# EAGLE design MaquetaConejos_2 (EAGLE 9.5.1)
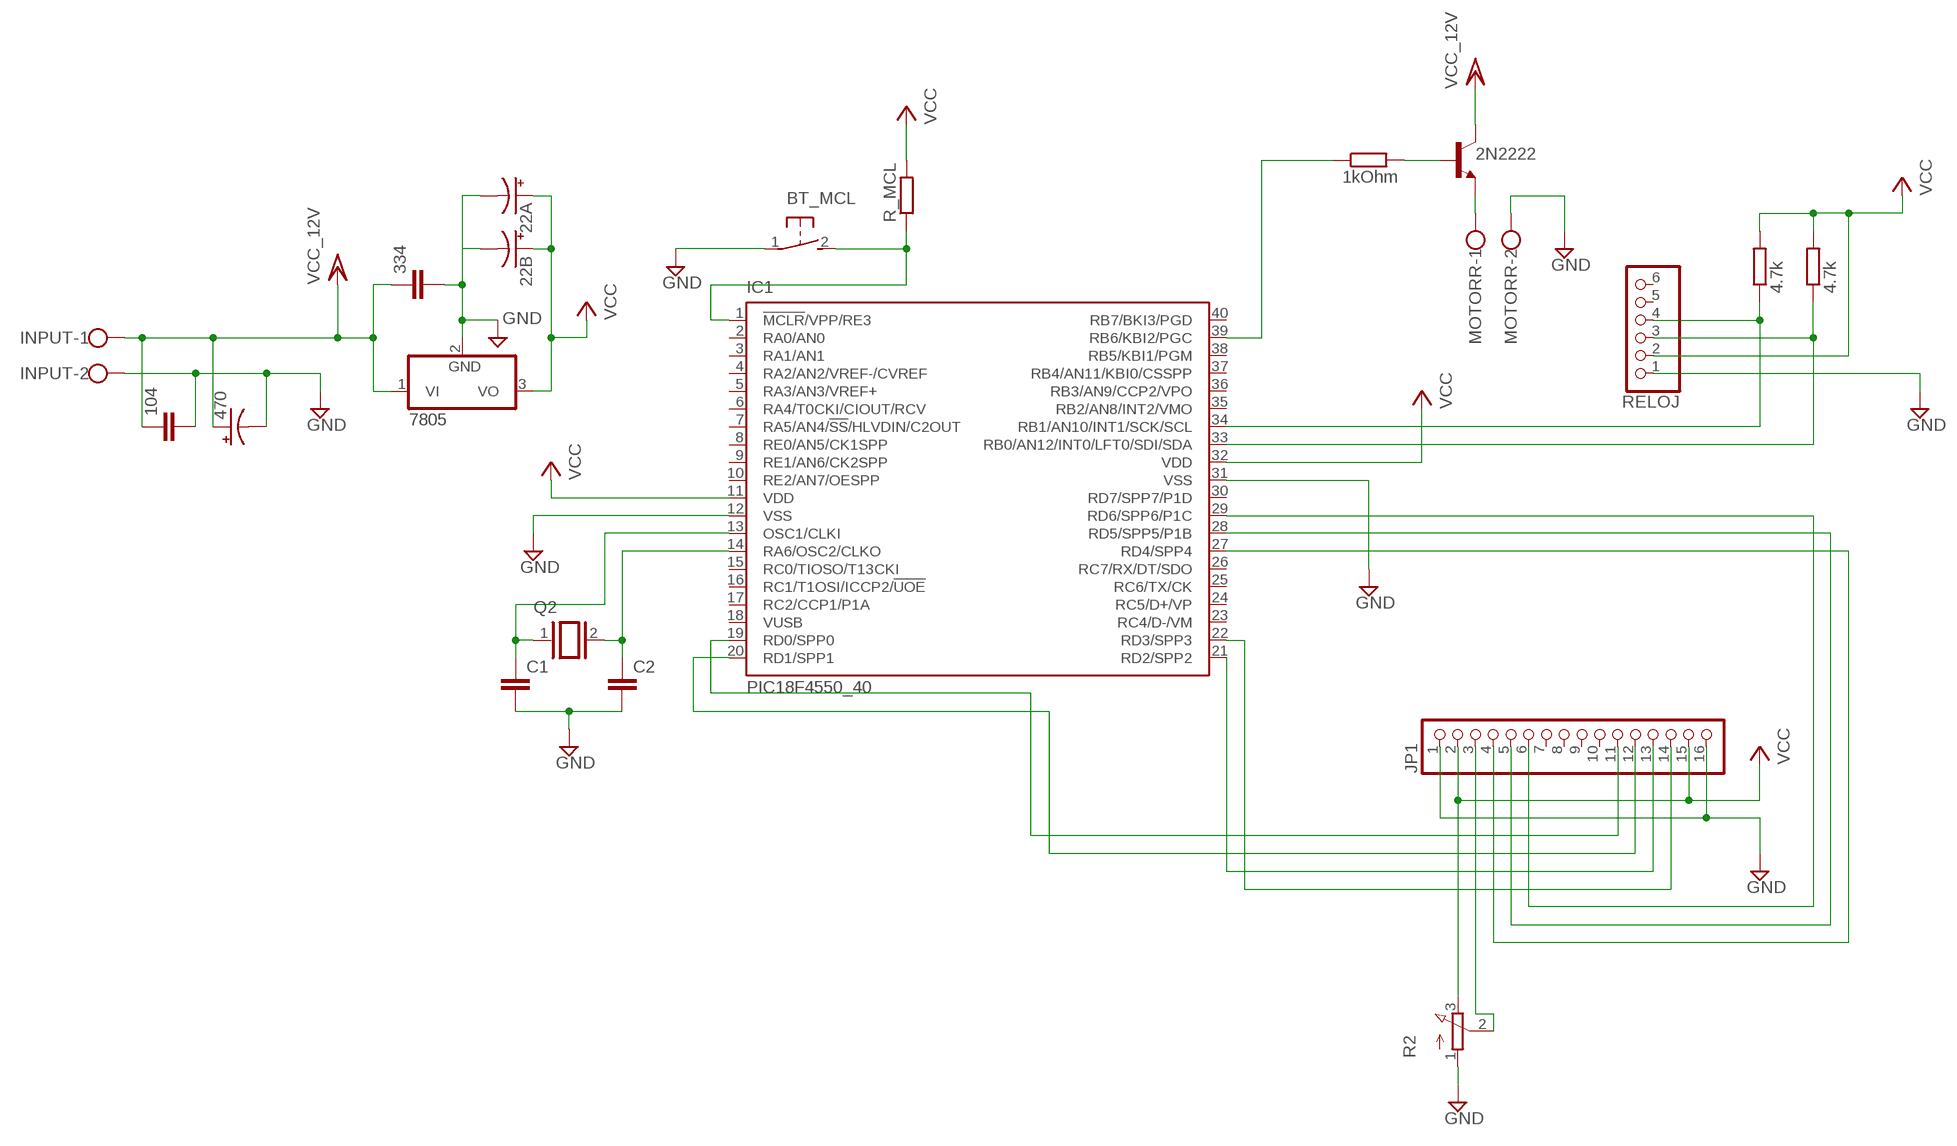
[diagram p0: schematic, sheet 1]

## Parts
22A  CPOL-USE1.8-4  [E1,8-4]
22B  CPOL-USE1.8-4  [E1,8-4]
104  C-EU050-025X075  [C050-025X075]
334  C-EU050-025X075  [C050-025X075]
470  CPOL-USE5-10.5  [E5-10,5]
BT_MCL  DTS-3  [DTS-3]
C1  C-EU025-024X044  [C025-024X044]
C2  C-EU025-024X044  [C025-024X044]
IC1  PIC18F4550_40  [DIL40]
IC3  7805  7805TV  [TO220V]
INPUT  W237-102  [W237-102]
JP1  PINHD-1X16  [1X16]
MOTORR  W237-102  [W237-102]
Q2  XTAL/S  [QS]
R1  4.7k  R-EU_0204/7  [0204/7]
R2  3RP/1610N  [3RP/1610N]
R3  1kOhm  R-EU_0204/7  [0204/7]
R4  4.7k  R-EU_0204/7  [0204/7]
R_MCL  R-EU_0204/7  [0204/7]
RELOJ  PINHD-1X6  [1X06]
T1  2N2222  [TO92-EBC-OVAL]

## Nets
GND: 22A.- 22B.- 104.2 334.2 470.- BT_MCL.1 C1.2 C2.2 IC1.12(VSS) IC1.31(VSS) IC3.2(GND) INPUT.2 JP1.1 JP1.16 MOTORR.2 R2.1(A) RELOJ.1
N$1: BT_MCL.2 IC1.1(!MCLR!/VPP/RE3) R_MCL.1
N$2: IC1.39(RB6/KBI2/PGC) R3.1
N$3: R3.2 T1.B
N$4: IC1.34(RB1/AN10/INT1/SCK/SCL) R4.1 RELOJ.4
N$5: MOTORR.1 T1.E
N$6: C1.1 IC1.13(OSC1/CLKI) Q2.1
N$7: C2.1 IC1.14(RA6/OSC2/CLKO) Q2.2
N$8: IC1.33(RB0/AN12/INT0/LFT0/SDI/SDA) R1.1 RELOJ.3
N$12: JP1.3 R2.2(S)
N$13: IC1.19(RD0/SPP0) JP1.11
N$15: IC1.20(RD1/SPP1) JP1.12
N$16: IC1.21(RD2/SPP2) JP1.13
N$17: IC1.22(RD3/SPP3) JP1.14
N$18: IC1.27(RD4/SPP4) JP1.4
N$19: IC1.29(RD6/SPP6/P1C) JP1.6
N$20: IC1.28(RD5/SPP5/P1B) JP1.5
VCC: 22A.+ 22B.+ IC1.11(VDD) IC1.32(VDD) IC3.3(VO) JP1.2 JP1.15 R1.2 R2.3(E) R4.2 R_MCL.2 RELOJ.2
VCC/2: 104.1 334.1 470.+ IC3.1(VI) INPUT.1 T1.C ; supply symbol labelled VCC_12V
Unconnected: IC1.2(RA0/AN0) IC1.3(RA1/AN1) IC1.4(RA2/AN2/VREF-/CVREF) IC1.5(RA3/AN3/VREF+) IC1.6(RA4/T0CKI/CIOUT/RCV) IC1.7(RA5/AN4/!SS!/HLVDIN/C2OUT) IC1.8(RE0/AN5/CK1SPP) IC1.9(RE1/AN6/CK2SPP) IC1.10(RE2/AN7/OESPP) IC1.15(RC0/TIOSO/T13CKI) IC1.16(RC1/T1OSI/ICCP2/!UOE) IC1.17(RC2/CCP1/P1A) IC1.18(VUSB) IC1.23(RC4/D-/VM) IC1.24(RC5/D+/VP) IC1.25(RC6/TX/CK) IC1.26(RC7/RX/DT/SDO) IC1.30(RD7/SPP7/P1D) IC1.35(RB2/AN8/INT2/VMO) IC1.36(RB3/AN9/CCP2/VPO) IC1.37(RB4/AN11/KBI0/CSSPP) IC1.38(RB5/KBI1/PGM) IC1.40(RB7/BKI3/PGD) JP1.7 JP1.8 JP1.9 JP1.10 RELOJ.5 RELOJ.6

## Library data of the parts
22A 22B 470 = rcl:CPOL-US: POLARIZED CAPACITOR, American symbol; SPICEPREFIX: C
104 334 C1 C2 = rcl:C-EU: CAPACITOR, European symbol; SPICEPREFIX: C
BT_MCL = switch-tact:DTS-3
IC1 = microchip:PIC18F4*_40: USB Microcontrollers with nanoWatt Technology High-Performance, Enhanced Flash, 28/40/44-Pin, Source: http://ww1.microchip.com/downloads/en/devicedoc/39632c.pdf; MF: MICROCHIP; MPN: PIC18F4550-I/P; OC_FARNELL: 9321357; OC_NEWARK: 74K8623
IC3 = linear:78*: Positive VOLTAGE REGULATOR Source: http://cache.national.com/ds/LM/LM78L05.pdf http://www.fairchildsemi.com/ds/LM/LM7805.pdf
INPUT MOTORR = con-wago-500:W237-102: WAGO SCREW CLAMP; MPN: 237-102; OC_FARNELL: unknown; OC_NEWARK: 70K9898
JP1 = pinhead:PINHD-1X16: PIN HEADER
Q2 = special:XTAL/S: CRYSTAL
R1 R3 R4 R_MCL = rcl:R-EU_: RESISTOR, European symbol; SPICEPREFIX: R
R2 = pot:3RP/1610N: 16mm Potentiometer one level Source: http://www.alphapotentiometers.net/html/16mm_pot_2.html
RELOJ = pinhead:PINHD-1X6: PIN HEADER
T1 = adafruit:2N2222: NPN TRANSISTOR Big oval pads

## Board
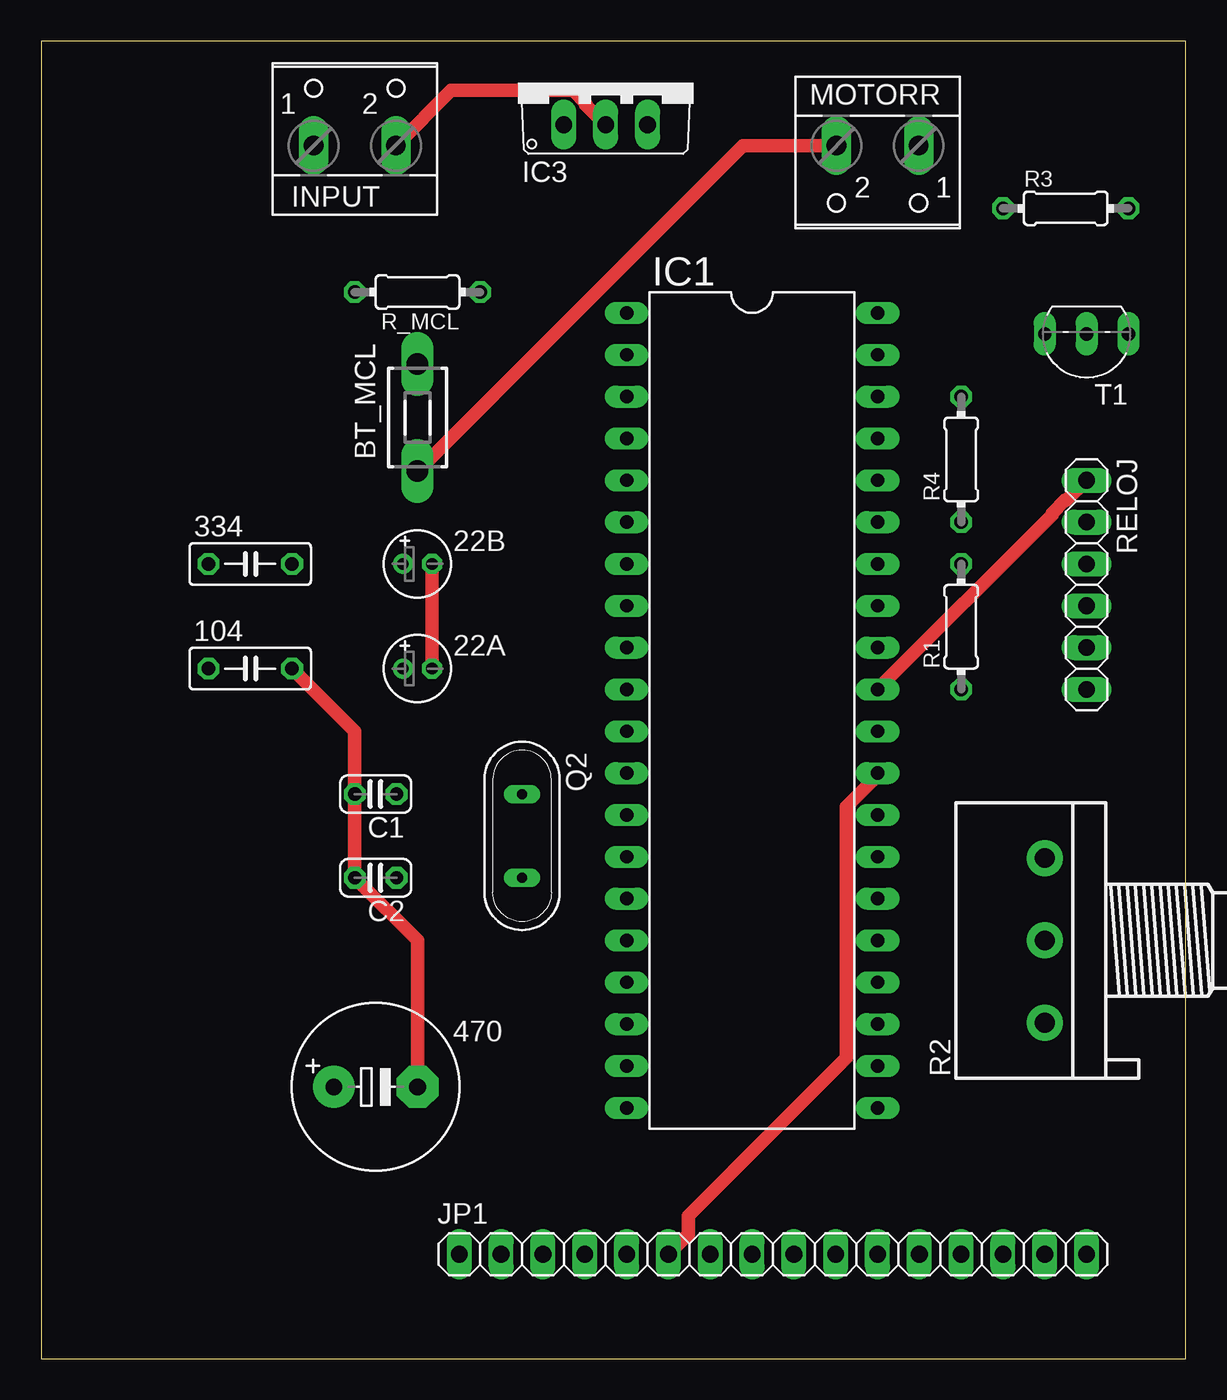
[diagram p1: board, top side]
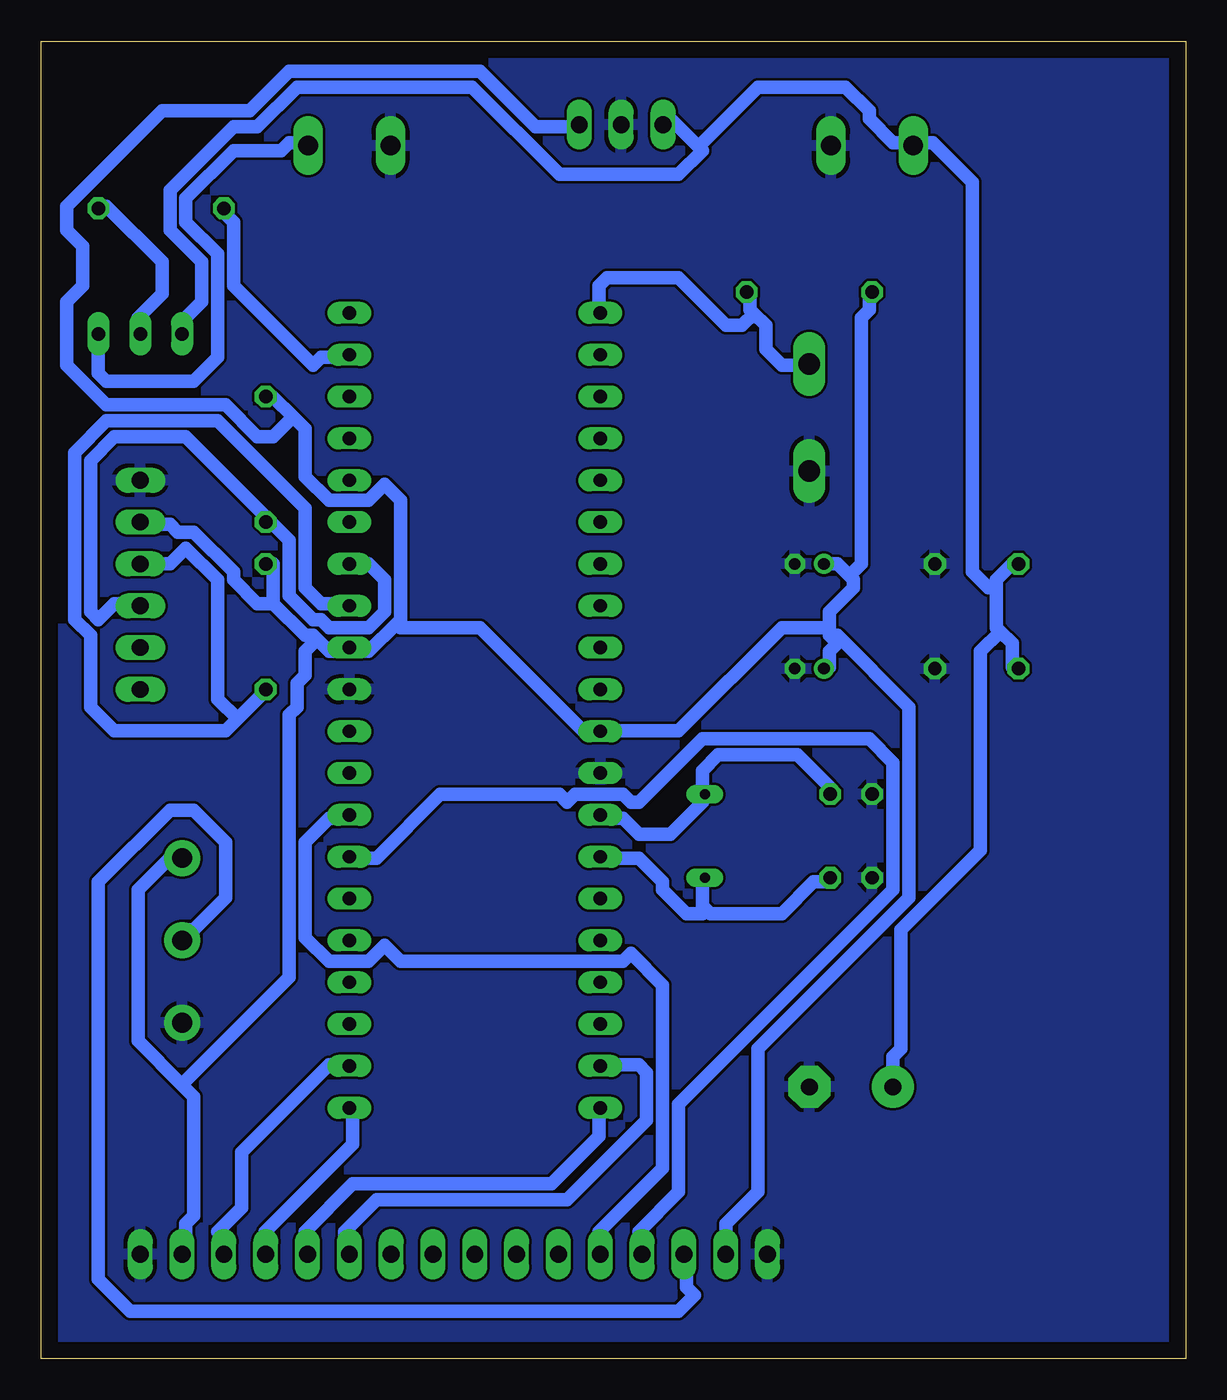
[diagram p2: board, bottom side, seen from below]

Size 69.52 x 80 mm. Coordinates in mm from the lower left corner, seen from the top.
Outline: 0,0 69.52,0 69.52,80 0,80 0,0
Copper layers (1*16): Top 0.035mm / dielectric 1.5mm / Bottom 0.035mm
Design rules "default *": minimum track width 32mil, minimum drill 0.6mm, track to track 6mil, track to pad 6mil, pad to pad 6mil, via to via 6mil, smd to smd 6mil, copper to edge 40mil, drill to drill 6mil, minimum pad ring 10mil, minimum via ring 8mil, stop-mask expansion 4mil, vias tented up to drill 0mil, thermal gap 10mil

### Footprints (pad centres in the part's own frame; a part is rotated, then mirrored left to right if it is on the bottom)
E1,8-4 = drill 0.711 pad 1.168: + -0.889,0 | drill 0.711 pad 1.168 octagon: - 0.889,0
C050-025X075 = drill 0.813 octagon: 1 -2.54,0; 2 2.54,0
E5-10,5 = drill 1.016 pad 2.54: + -2.54,0 | drill 1.016 pad 2.54 octagon: - 2.54,0
DTS-3 = drill 1.3 long: 1 -3.25,0; 2 3.25,0
C025-024X044 = drill 0.813 octagon: 1 -1.27,0; 2 1.27,0
DIL40 = drill 0.813 long: 1 -24.13,-7.62; 2 -21.59,-7.62; 3 -19.05,-7.62; 4 -16.51,-7.62; 5 -13.97,-7.62; 6 -11.43,-7.62; 7 -8.89,-7.62; 8 -6.35,-7.62; 9 -3.81,-7.62; 10 -1.27,-7.62; 11 1.27,-7.62; 12 3.81,-7.62; 13 6.35,-7.62; 14 8.89,-7.62; 15 11.43,-7.62; 16 13.97,-7.62; 17 16.51,-7.62; 18 19.05,-7.62; 19 21.59,-7.62; 20 24.13,-7.62; 21 24.13,7.62; 22 21.59,7.62; 23 19.05,7.62; 24 16.51,7.62; 25 13.97,7.62; 26 11.43,7.62; 27 8.89,7.62; 28 6.35,7.62; 29 3.81,7.62; 30 1.27,7.62; 31 -1.27,7.62; 32 -3.81,7.62; 33 -6.35,7.62; 34 -8.89,7.62; 35 -11.43,7.62; 36 -13.97,7.62; 37 -16.51,7.62; 38 -19.05,7.62; 39 -21.59,7.62; 40 -24.13,7.62
TO220V = drill 1.016 long: 1 -2.54,-2.54; 2 0,-2.54; 3 2.54,-2.54
W237-102 = drill 1.194 long: 1 -2.5,-1.27; 2 2.5,-1.27
1X16 = drill 1.016 long: 1 -19.05,0; 2 -16.51,0; 3 -13.97,0; 4 -11.43,0; 5 -8.89,0; 6 -6.35,0; 7 -3.81,0; 8 -1.27,0; 9 1.27,0; 10 3.81,0; 11 6.35,0; 12 8.89,0; 13 11.43,0; 14 13.97,0; 15 16.51,0; 16 19.05,0
QS = drill 0.61 long: 1 -2.54,0; 2 2.54,0
0204/7 = drill 0.813 octagon: 1 -3.81,0; 2 3.81,0
3RP/1610N = drill 1.2 pad 2.184: 1 -5,0; 2 0,0; 3 5,0
1X06 = drill 1.016 long: 1 -6.35,0; 2 -3.81,0; 3 -1.27,0; 4 1.27,0; 5 3.81,0; 6 6.35,0
TO92-EBC-OVAL = drill 0.813 long: B 0,-1.27; C 2.54,-1.27; E -2.54,-1.27

### Placement (x,y rotation side)
22A  22.86,41.91 0 top
22B  22.86,48.26 0 top
104  12.7,41.91 0 top
334  12.7,48.26 0 top
470  20.32,16.51 0 top
BT_MCL  22.86,57.15 90 top
C1  20.32,34.29 180 top
C2  20.32,29.21 180 top
IC1  43.18,39.37 270 top
IC3  34.29,77.47 0 top
INPUT  19.05,74.93 0 top
JP1  44.45,6.35 0 top
MOTORR  50.8,72.39 180 top
Q2  29.21,31.75 270 top
R1  55.88,44.45 90 top
R2  60.96,25.4 90 top
R3  62.23,69.85 0 top
R4  55.88,54.61 90 top
R_MCL  22.86,64.77 180 top
RELOJ  63.5,46.99 270 top
T1  63.5,60.96 180 top

### Tracks (layer width: path | path; a pad name or v marks a point on that pad's centre or on a via)
GND
  Top 0.813: RELOJ.1 62.28,52.12 62.19,52.12 61.42,51.35 61.42,51.26 IC1.31 | 104.2 19.05,38.1 C1.2 C2.2 22.86,25.4 470.- | 22A.- 22B.- | IC3.2 33.07,76.15 33.07,76.24 32.3,77.01 24.9,77.01 INPUT.2 | BT_MCL.1 42.62,73.66 MOTORR.2
  pour Bottom: -1.27,82.55 -1.27,-2.54 72.39,-2.54 72.39,82.55
N$1
  Bottom 0.813: 26.23,63.46 25.5,62.74 25.5,61.29 24.54,60.33 23.09,60.33 BT_MCL.2 | 26.23,63.46 26.47,63.7 26.47,64.67 R_MCL.1 | 26.23,63.46 26.95,62.74 27.92,62.74 30.81,65.63 35.15,65.63 35.64,65.15 35.64,63.7 IC1.1
N$2
  Bottom 0.813: IC1.39 51.08,60.81 52.53,60.81 53.01,60.33 57.84,65.15 57.84,69.01 58.32,69.49 R3.1
N$3
  Bottom 0.813: T1.B 63.63,62.26 63.63,63.22 62.18,64.67 62.18,66.6 65.56,69.98 66.04,69.98 R3.2
N$4
  Bottom 0.813: IC1.34 49.63,48.26 48.67,47.3 48.67,45.36 49.63,44.4 52.05,44.4 52.53,44.88 53.01,44.88 54.46,46.33 54.46,49.71 55.42,50.67 R4.1 55.91,51.16 60.73,55.98 65.08,55.98 66.52,54.53 66.52,45.36 66.04,44.88 65.08,45.85 63.63,45.85 RELOJ.4
N$5
  Bottom 0.813: T1.E 66.04,59.84 65.56,59.36 60.25,59.36 58.8,60.81 58.8,67.08 60.73,69.01 60.73,70.46 57.84,73.36 54.94,73.36 54.46,73.84 53.49,73.84 MOTORR.1
N$6
  Bottom 0.813: 29.36,34.75 29.36,35.71 28.4,36.68 23.57,36.68 21.64,34.75 C1.1 | 29.36,34.75 29.85,34.27 29.36,33.78 31.29,31.85 33.22,31.85 34.19,32.82 35.15,32.82 IC1.13 | 29.36,34.75 Q2.1
N$7
  Bottom 0.813: 29.12,27.27 28.88,27.03 24.54,27.03 22.61,28.96 21.64,28.96 C2.1 | 29.12,27.27 29.36,27.51 29.36,28.96 Q2.2 | IC1.14 35.15,30.4 33.22,30.4 31.78,28.96 31.78,28.47 30.33,27.03 29.36,27.03 29.12,27.27
N$8
  Bottom 0.813: 57.59,38.85 55.91,40.54 R1.1 | 57.59,38.85 58.32,38.12 65.08,38.12 66.52,39.57 66.52,43.92 67.49,44.88 67.49,55.02 65.56,56.95 58.8,56.95 53.49,51.64 53.49,46.81 52.53,45.85 51.08,45.85 IC1.33 | RELOJ.3 61.7,48.26 60.73,49.23 58.8,47.3 58.8,40.06 57.59,38.85
N$12
  Bottom 0.813: JP1.3 30.33,6.27 30.33,4.34 29.85,3.86 30.81,2.9 64.11,2.9 66.04,4.83 66.04,28.96 61.7,33.3 60.25,33.3 58.32,31.37 58.32,27.99 60.25,26.06 60.73,26.06 61.21,25.58 R2.2
N$13
  Bottom 0.813: IC1.19 35.15,17.86 33.22,17.86 32.74,17.37 32.74,14.48 37.57,9.65 49.15,9.65 51.08,7.72 51.08,6.76 JP1.11
N$15
  Bottom 0.813: IC1.20 35.64,14.96 35.64,13.51 38.53,10.62 50.6,10.62 53.49,7.72 53.49,6.76 JP1.12
N$16
  Bottom 0.813: IC1.21 50.6,14.96 50.6,13.03 55.91,7.72 55.91,6.76 JP1.13
N$17
  Bottom 0.813: IC1.22 51.08,17.86 52.05,17.86 57.35,12.55 57.35,9.17 58.8,7.72 58.32,7.24 58.32,6.76 JP1.14
N$18
  Bottom 0.813: IC1.27 50.6,30.4 49.15,30.4 45.29,34.27 38.05,34.27 37.57,33.78 37.08,34.27 34.19,34.27 33.71,33.78 33.22,33.78 29.36,37.64 19.23,37.64 17.78,36.2 17.78,28.47 30.81,15.44 30.81,10.13 33.22,7.72 33.22,6.76 JP1.4
N$19
  Top 0.813: JP1.6 39.32,7.57 39.32,8.68 48.92,18.29 48.92,33.52 50.8,35.41 IC1.29
N$20
  Bottom 0.813: IC1.28 51.08,32.82 52.05,32.82 53.49,31.37 53.49,25.58 52.05,24.13 49.63,24.13 48.67,25.09 47.7,24.13 34.19,24.13 33.71,24.61 31.78,22.68 31.78,11.58 35.64,7.72 35.64,6.76 JP1.5
VCC
  Bottom 0.813: 21.4,43.67 21.64,43.92 21.64,44.4 | 21.4,43.67 21.16,43.43 21.64,42.95 21.64,41.99 22A.+ | 21.64,44.4 21.64,45.36 20.19,46.81 20.19,47.3 20.43,47.54 | 20.43,47.54 21.16,48.26 22B.+ | 21.64,44.4 24.54,44.4 30.81,38.12 35.15,38.12 IC1.11 35.64,38.12 36.6,38.12 42.88,44.4 47.7,44.4 47.94,44.64 | 20.43,47.54 19.71,48.26 19.71,63.22 19.23,63.7 19.23,64.67 R_MCL.2 | JP1.2 27.92,6.76 27.92,8.2 25.98,10.13 25.98,18.82 16.82,27.99 16.82,39.57 21.16,43.92 21.4,43.67 | 60.97,16.65 63.63,19.3 63.63,28.47 61.21,30.89 60.73,30.4 R2.3 | 60.97,16.65 60.25,15.93 60.25,8.69 60.73,8.2 60.73,6.76 JP1.15 | 52.77,43.67 53.01,43.92 53.49,43.92 55.42,45.85 | 52.77,43.67 52.05,42.95 51.08,42.95 IC1.32 50.6,42.95 49.63,42.95 47.94,44.64 | 55.42,45.85 55.42,48.26 R1.2 | 54.22,57.19 53.49,56.46 53.49,53.57 52.05,52.12 49.63,52.12 48.67,53.09 47.7,52.12 47.7,44.88 47.94,44.64 | 54.22,57.19 55.42,58.4 R4.2 | 55.42,45.85 56.39,45.85 57.84,47.3 57.84,47.78 60.25,50.19 61.21,50.19 61.7,50.67 63.14,50.67 RELOJ.2 | 54.22,57.19 55.42,55.98 56.39,55.98 58.32,57.91 65.56,57.91 67.97,60.33 67.97,64.19 67,65.15 67,67.56 67.97,68.53 67.97,69.98 62.18,75.77 56.87,75.77 54.46,78.18 42.88,78.18 39.5,74.8 37.08,74.8 IC3.3 | 60.97,16.65 54.46,23.16 54.46,39.09 53.97,39.57 53.97,41.02 53.49,41.5 53.49,42.95 52.77,43.67
VCC/2
  Bottom 0.813: 11.26,44.16 11.51,44.4 11.51,46.81 | 11.26,44.16 10.54,43.43 10.54,41.99 104.1 | 11.51,46.81 11.51,47.3 10.54,48.26 334.1 | 29.6,73.6 31.29,75.29 IC3.1 | 29.6,73.6 29.36,73.36 30.81,71.91 38.05,71.91 43.36,77.22 53.97,77.22 56.39,74.8 57.84,74.8 61.7,70.94 61.7,68.53 59.77,66.6 59.77,64.19 60.73,63.22 60.73,62.26 T1.C | 29.6,73.6 25.98,77.22 20.68,77.22 19.23,75.77 19.23,75.29 17.78,73.84 16.82,73.84 INPUT.1 16.33,73.84 15.37,73.84 12.95,71.42 12.95,47.78 11.99,46.81 11.51,46.81 | 470.+ 17.78,18.34 17.3,18.82 17.3,26.06 12.47,30.89 12.47,42.95 11.26,44.16